# EAGLE design Femtoduino (EAGLE 8.4.3)
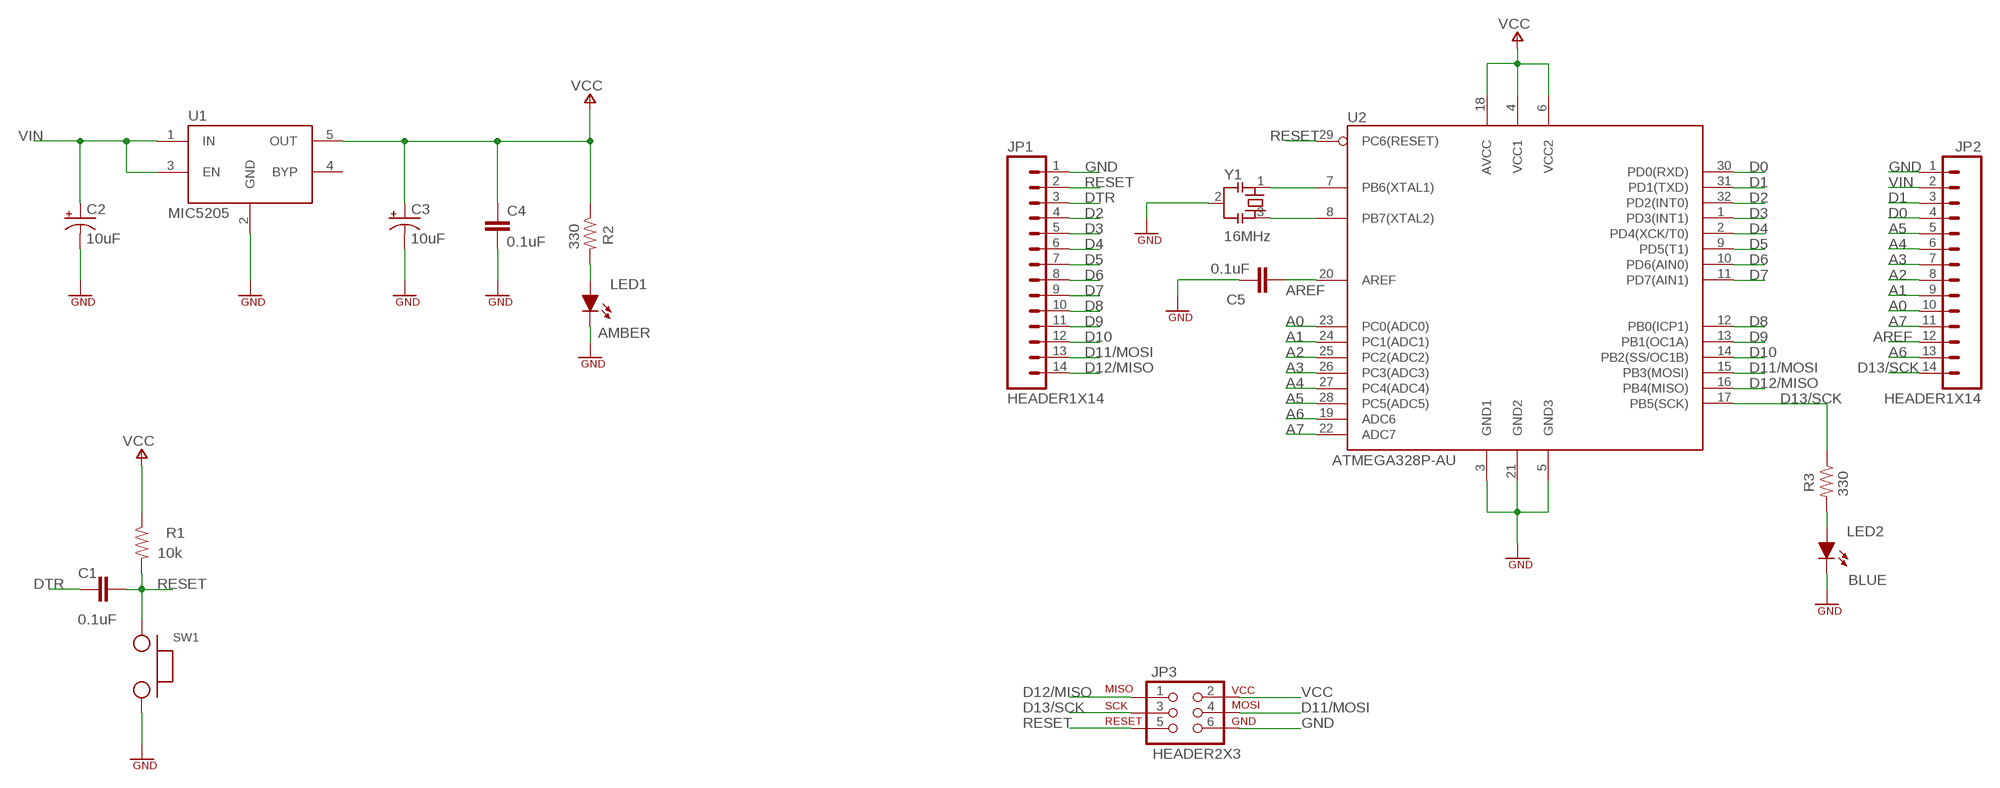
[diagram p0: schematic, sheet 1]

## Parts
C1  0.1uF  CAP_0603  [SMD0603]
C2  10uF  CAP_TANT  [EIA3216]
C3  10uF  CAP_TANT  [EIA3216]
C4  0.1uF  CAP_0603  [SMD0603]
C5  0.1uF  CAP_0603  [SMD0603]
JP1  HEADER1X14  [1X14]
JP2  HEADER1X14  [1X14]
JP3  HEADER2X3  [2X3]
LED1  AMBER  LED_0603  [LED_0603]
LED2  BLUE  LED_0805  [LED_0805]
R1  10k  RES_0603  [SMD0603]
R2  330  RES_0603  [SMD0603]
R3  330  RES_0603  [SMD0603]
SW1  SWITCH  [SWITCH-SPST]
U1  MIC5205  [SOT23-5]
U2  ATMEGA328P-AU  [TQFP32]
Y1  16MHz  CSTCE  [CSTCE]

## Nets
A0: JP2.10 U2.23(PC0(ADC0))
A1: JP2.9 U2.24(PC1(ADC1))
A2: JP2.8 U2.25(PC2(ADC2))
A3: JP2.7 U2.26(PC3(ADC3))
A4: JP2.6 U2.27(PC4(ADC4))
A5: JP2.5 U2.28(PC5(ADC5))
A6: JP2.13 U2.19(ADC6)
A7: JP2.11 U2.22(ADC7)
AREF: C5.1 JP2.12 U2.20(AREF)
D0: JP2.4 U2.30(PD0(RXD))
D1: JP2.3 U2.31(PD1(TXD))
D2: JP1.4 U2.32(PD2(INT0))
D3: JP1.5 U2.1(PD3(INT1))
D4: JP1.6 U2.2(PD4(XCK/T0))
D5: JP1.7 U2.9(PD5(T1))
D6: JP1.8 U2.10(PD6(AIN0))
D7: JP1.9 U2.11(PD7(AIN1))
D8: JP1.10 U2.12(PB0(ICP1))
D9: JP1.11 U2.13(PB1(OC1A))
D10: JP1.12 U2.14(PB2(SS/OC1B))
D11/MOSI: JP1.13 JP3.4 U2.15(PB3(MOSI))
D12/MISO: JP1.14 JP3.1 U2.16(PB4(MISO))
D13/SCK: JP2.14 JP3.3 R3.1 U2.17(PB5(SCK))
DTR: C1.1 JP1.3
GND [GND]: C2.C(-) C3.C(-) C4.2 C5.2 JP1.1 JP2.1 JP3.6 LED1.C LED2.C SW1.2 U1.2(GND) U2.3(GND1) U2.5(GND3) U2.21(GND2) Y1.2
N$2: LED1.A R2.2
N$3: U2.7(PB6(XTAL1)) Y1.1
N$4: U2.8(PB7(XTAL2)) Y1.3
N$8: LED2.A R3.2
RESET: C1.2 JP1.2 JP3.5 R1.2 SW1.1 U2.29(PC6(RESET))
VCC: C3.A(+) C4.1 JP3.2 R1.1 R2.1 U1.5(OUT) U2.4(VCC1) U2.6(VCC2) U2.18(AVCC)
VIN: C2.A(+) JP2.2 U1.1(IN) U1.3(EN)
Unconnected: U1.4(BYP)

## Library data of the parts
C1 C4 C5 = eagle-book:CAP: Non-polarized capacitor
C2 C3 = eagle-book:CAP_TANT: Polarized capacitor (Tantalum)
JP1 JP2 = eagle-book:HEADER1X14: 14-pin header with pins spaced 0.1" apart
JP3 = eagle-book:HEADER2X3: 6-pin header with pins spaced 0.1" apart (HEADD6)
LED1 LED2 = eagle-book:LED: Light Emitting Diode
R1-R3 = eagle-book:RES: Resistor
SW1 = eagle-book:SWITCH: Two-input single pole, single throw (SPST) switch
U1 = eagle-book:MIC5205: 5-volt voltage regulator (UA78M05)
U2 = eagle-book:ATMEGA328P: Atmel 32-pin 8-bit microcontroller
Y1 = eagle-book:CSTCE: SMD resonator from Murata (CSTCE16M0V53-S0)

## Net classes
0 default: width 0.203 mm
1 VCC: width 0.305 mm, drill 0.406 mm
2 VIN: width 0.305 mm, drill 0.406 mm
3 AREF: width 0.254 mm, drill 0.406 mm
4 GND: width 0.254 mm, drill 0.406 mm

## Board
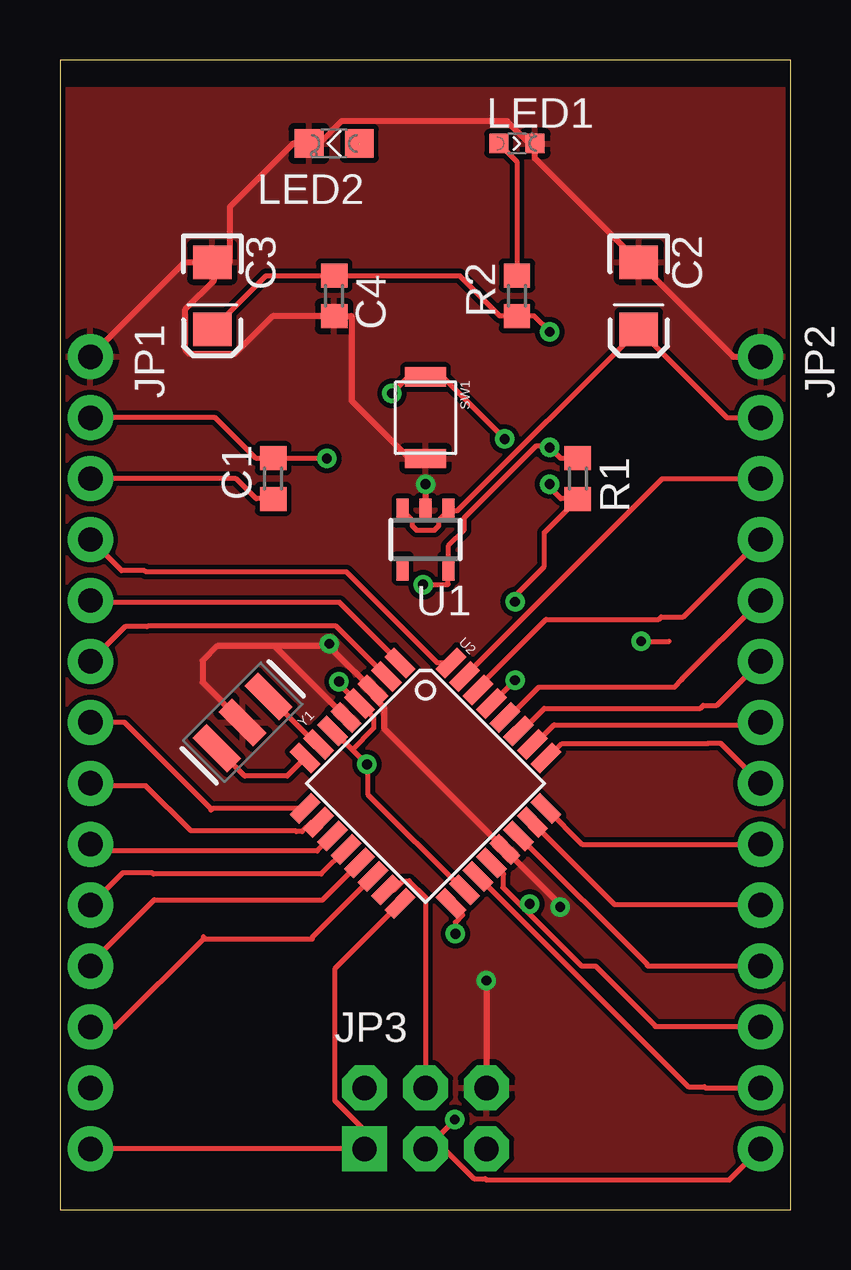
[diagram p1: board, top side]
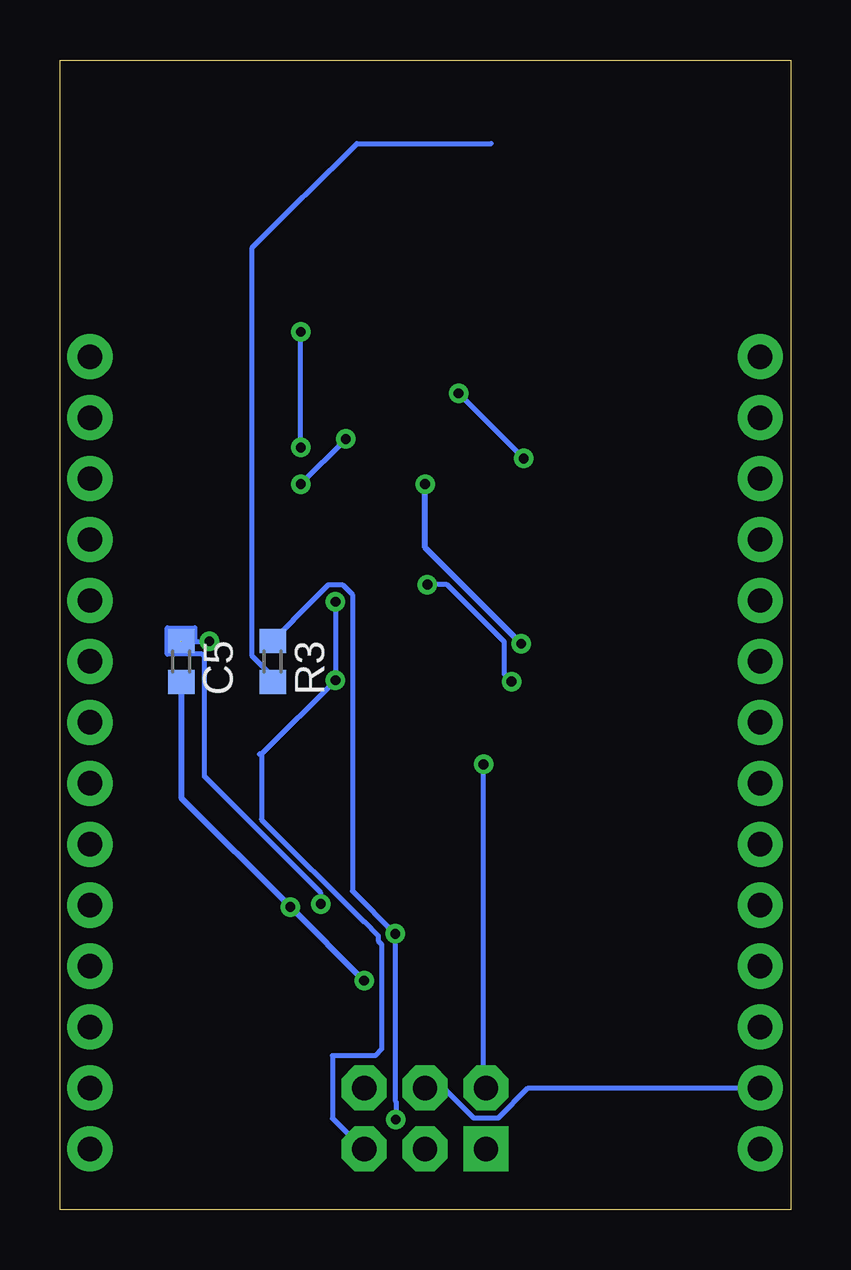
[diagram p2: board, bottom side, seen from below]

Size 30.46 x 47.93 mm. Coordinates in mm from the lower left corner, seen from the top.
Outline: 0,0 30.46,0 30.46,47.93 0,47.93 0,0
Copper layers (1*16): Top 0.035mm / dielectric 1.5mm / Bottom 0.035mm
Design rules "femtoduino": minimum track width 8mil, minimum drill 16mil, track to track 8mil, track to pad 8mil, pad to pad 8mil, via to via 8mil, smd to smd 8mil, copper to edge 8mil, drill to drill 8mil, minimum pad ring 10mil, minimum via ring 8mil, stop-mask expansion 4mil, vias tented up to drill 0mil, thermal gap 10mil

### Footprints (pad centres in the part's own frame; a part is rotated, then mirrored left to right if it is on the bottom)
SMD0603 = smd 1 x 1.1: 1 -0.85,0; 2 0.85,0
EIA3216 = smd 1.4 x 1.6: A 1.4,0; C -1.4,0
1X14 = drill 1.016 pad 1.88: 1 0,0; 2 2.54,0; 3 5.08,0; 4 7.62,0; 5 10.16,0; 6 12.7,0; 7 15.24,0; 8 17.78,0; 9 20.32,0; 10 22.86,0; 11 25.4,0; 12 27.94,0; 13 30.48,0; 14 33.02,0
2X3 = drill 1.016 pad 1.88 square: 1 -2.54,-1.27 | drill 1.016 pad 1.88 octagon: 2 -2.54,1.27; 3 0,-1.27; 4 0,1.27; 5 2.54,-1.27; 6 2.54,1.27
LED_0603 = smd 0.8 x 0.8: A 0,-0.75; C 0,0.75
LED_0805 = smd 1.2 x 1.2: A 0,-1.05; C 0,1.05
SWITCH-SPST = smd 0.8 x 1.7: 1 -1.7,0; 2 1.7,0
SOT23-5 = smd 0.5 x 1: 1 -0.95,-1.2; 2 0,-1.2; 3 0.95,-1.2; 4 0.95,1.2; 5 -0.95,1.2
TQFP32 = smd 1.27 x 0.559: 1 -4.293,2.8; 2 -4.293,2; 3 -4.293,1.2; 4 -4.293,0.4; 5 -4.293,-0.4; 6 -4.293,-1.2; 7 -4.293,-2; 8 -4.293,-2.8; 17 4.293,-2.8; 18 4.293,-2; 19 4.293,-1.2; 20 4.293,-0.4; 21 4.293,0.4; 22 4.293,1.2; 23 4.293,2; 24 4.293,2.8 | smd 0.559 x 1.27: 9 -2.8,-4.293; 10 -2,-4.293; 11 -1.2,-4.293; 12 -0.4,-4.293; 13 0.4,-4.293; 14 1.2,-4.293; 15 2,-4.293; 16 2.8,-4.293; 25 2.8,4.293; 26 2,4.293; 27 1.2,4.293; 28 0.4,4.293; 29 -0.4,4.293; 30 -1.2,4.293; 31 -2,4.293; 32 -2.8,4.293
CSTCE = smd 0.8 x 2.032: 1 -1.524,0; 2 0,0; 3 1.524,0

### Placement (x,y rotation side)
C1  8.89,30.48 90 top
C2  24.13,38.1 270 top
C3  6.35,38.1 270 top
C4  11.43,38.1 270 top
C5  25.4,22.86 270 bottom
JP1  1.27,35.56 270 top
JP2  29.21,35.56 270 top
JP3  15.24,3.81 0 top
LED1  19.05,44.45 270 top
LED2  11.43,44.45 90 top
R1  21.59,30.48 270 top
R2  19.05,38.1 90 top
R3  21.59,22.86 270 bottom
SW1  15.24,33.02 270 top
U1  15.24,27.94 180 top
U2  15.24,17.78 315 top
Y1  7.62,20.32 225 top

### Tracks (layer width: path | path; a pad name or v marks a point on that pad's centre or on a via)
A0
  Top 0.203: U2.23 23.12,12.72 29.18,12.72 JP2.10
A1
  Top 0.203: U2.24 20.28,16.73 21.77,15.24 JP2.9
A2
  Top 0.203: U2.25 20.33,18.84 20.93,19.43 27,19.43 27.03,19.46 27.53,19.46 JP2.8
A3
  Top 0.203: U2.26 19.78,19.4 20.6,20.22 29.11,20.22 JP2.7
A4
  Top 0.203: U2.27 19.26,19.97 20.19,20.9 26.7,20.9 26.82,21.03 27.38,21.03 JP2.6
A5
  Top 0.203: U2.28 18.7,20.53 19.96,21.79 25.63,21.79 25.93,22.1 25.93,22.12 JP2.5
A6
  Top 0.203: U2.19 26.19,5.13 26.87,5.13 26.92,5.08 JP2.13
A7
  Top 0.203: U2.22 24.49,10.23 24.49,10.19 24.51,10.16 JP2.11
AREF  (via drill 0.41)  (1 unrouted)
  Top 0.203: JP2.12 29.18,7.64 24.84,7.64 | 24.84,7.64 24.81,7.64 | 19.37,12.54 18.47,13.44 18.47,13.97 18.49,13.99 18.01,14.48 U2.20 | 19.37,12.54 21.74,10.16 22.33,10.16 24.84,7.64 | v24.23,23.7 25.4,23.7 | 19.37,12.54 v19.58,12.75
  Bottom 0.203: v24.23,23.7 24.84,23.7 24.84,24.26 25.98,24.26 25.98,23.16 24.54,23.16 24.43,23.06 24.43,18.06 19.58,13.21 v19.58,12.75
D0
  Top 0.203: U2.30 17.43,21.77 20.27,24.61 24.97,24.61 25.07,24.71 25.98,24.71 JP2.4
D1
  Top 0.203: U2.31 25.11,30.48 JP2.3
D2
  Top 0.203: U2.32 15.74,22.8 11.94,26.59 3.58,26.59 3.53,26.64 2.56,26.64 JP1.4
D3
  Top 0.203: U2.1 11.66,25.32 1.35,25.32 JP1.5
D4
  Top 0.203: U2.2 11.52,24.33 3.66,24.33 3.63,24.31 2.72,24.31 JP1.6
D5
  Top 0.203: U2.9 6.36,16.73 6.3,16.66 6.3,16.71 2.69,20.32 JP1.7
D6
  Top 0.203: U2.10 10.48,16.16 10.1,15.77 9.85,15.77 9.82,15.8 5.46,15.8 3.58,17.68 1.37,17.68 JP1.8
D7
  Top 0.203: U2.11 10.72,14.96 1.55,14.96 JP1.9
D8
  Top 0.203: U2.12 10.89,13.99 3.89,13.99 3.83,14.05 2.62,14.05 JP1.10
D9
  Top 0.203: U2.13 10.93,12.9 3.96,12.9 3.94,12.93 1.27,10.26 JP1.11
D10
  Top 0.203: U2.14 10.52,11.36 10.52,11.28 6.07,11.28 5.99,11.35 | 5.97,11.38 5.99,11.35 | 5.99,11.35 5.99,11.3 2.31,7.62 JP1.12
D11/MOSI
  Top 0.203: U2.15 13.92,13.33 14.31,13.72 14.56,13.72 15.24,13.04 JP3.4
  Bottom 0.203: JP3.4 14.46,5.08 13.22,3.83 12.18,3.83 10.94,5.08 JP1.13
D12/MISO
  Top 0.203: JP1.14 JP3.1 12.7,3.32 11.46,4.56 11.46,10.04 U2.16
D13/SCK  (via drill 0.41)
  Top 0.203: v16.46,3.76 JP3.3 16.02,2.54 17.26,1.29 17.73,1.29 17.78,1.25 27.91,1.25 JP2.14 | v16.48,11.51 16.48,11.99 16.79,12.29 16.31,12.78 U2.17
  Bottom 0.203: v16.46,3.76 16.46,4.52 16.48,4.55 v16.48,11.51 18.26,13.28 18.26,25.64 18.68,26.06 19.27,26.06 20.73,24.59 20.73,24.57 R3.1
DTR
  Top 0.203: JP1.3 7.34,30.48 8.18,29.64 8.89,29.64 C1.1
GND  (via drill 0.41)
  Top 0.254: U2.5 8.97,23.49 8.97,23.5 | 8.97,23.5 6.55,23.5 5.94,22.89 5.94,22 Y1.2 | 11.23,23.5 11.3,23.5 11.46,23.34 11.46,23.26 U2.3 13.05,21.39 13.51,20.93 13.51,20.07 U2.21 | 11.23,23.5 8.97,23.5 | JP2.1 28.07,35.56 C2.C 19.8,43.83 LED1.C 19.57,44.45 18.64,45.38 11.74,45.38 10.81,44.45 LED2.C 9.73,44.45 7.09,41.81 7.09,39.52 7.06,39.5 6.45,39.5 6.42,39.5 | JP1.1 5.21,39.5 C3.C 6.42,39.5 | SW1.2 14.58,31.32 12.17,33.73 12.17,37.24 12.14,37.26 11.43,37.26 C4.2 8.87,37.25 7.29,35.67 5.41,35.67 5.22,35.86 5.22,37.54 6.42,38.74 6.42,39.5 | v15.24,30.25 U1.2 | v11.23,23.6 11.23,23.5 | U2.21 | U2.21 20.85,12.72 v20.85,12.62 | v17.78,9.55 JP3.6
  Bottom 0.254: v15.24,30.25 15.24,27.61 v11.23,23.6 | v17.78,9.55 v20.85,12.62 25.4,17.17 C5.2
  pour Top: 0.25,46.74 0.25,0.25 30.23,0.25 30.23,46.74
  pour Top: 0.25,0.25 30.23,0.25 30.23,46.74 0.25,46.74
N$2
  Top 0.203: LED1.A 19.05,43.7 R2.2
N$3
  Top 0.203: U2.7 10.69,19.4 Y1.1
N$4
  Top 0.203: U2.8 9.58,18.19 | 9.58,18.19 | 9.58,18.19 9.47,18.09 7.7,18.09 Y1.3
N$8  (1 unrouted)
  Bottom 0.203: R3.2 21.59,22.23 22.45,23.08 22.45,40.12 20.32,42.24 20.24,42.29 18.09,44.45 LED2.A
RESET  (via drill 0.41)
  Top 0.203: 18.97,25.6 v18.97,25.35 19.02,25.65 20.19,26.82 20.19,28.23 R1.2 21.46,29.64 20.88,29.64 20.42,30.1 v20.42,30.25 | v18.97,22.07 18.01,21.11 U2.29 | v18.54,32.13 15.95,34.72 SW1.1 15.16,34.72 14.53,34.72 v13.84,34.04 | v11.12,31.32 8.89,31.32 C1.2 8.81,31.32 8.18,31.32 6.48,33.02 JP1.2
  Bottom 0.203: v18.97,25.35 v18.97,22.07 22.05,19 | v20.42,30.25 v18.54,32.13 | v13.84,34.04 v11.12,31.32 | 22.05,19 22.15,19 | 17.83,2.54 18.44,2.54 | 17.83,2.54 JP3.5 | 22.05,19 22.05,16.31 22.07,16.28 17.8,12.01 17.78,12.01 17.2,11.43 17.2,11.21 17.04,11.06 17.04,6.71 17.32,6.43 19.1,6.43 19.1,3.81 17.83,2.54
VCC  (via drill 0.41)
  Top 0.203: 12.19,19.18 11.38,19.99 U2.6 | 12.19,19.18 v12.8,18.57 12.85,18.49 12.85,17.3 16.84,13.31 U2.18 | 12.19,19.18 13.08,20.07 13.08,20.52 U2.4 12.42,21.13 11.63,21.92 v11.63,22.02 | v20.42,36.6 19.76,37.26 19.05,37.26 R2.1 18.97,37.26 18.34,37.26 16.66,38.94 11.43,38.94 | R1.1 21.59,31.32 20.88,31.32 v20.42,31.77 20.34,31.83 19.84,31.83 16.84,28.83 16.84,28.32 16.18,27.66 16.18,26.82 U1.5 16.18,26.72 16.18,26.09 16.15,26.06 v15.14,26.06 | 11.43,38.94 C4.1 | C3.A 8.59,38.94 11.43,38.94
  Bottom 0.203: 12.65,5.13 JP3.2 12.7,5.21 12.8,5.31 v12.8,18.57 | v20.42,31.77 v20.42,36.6 | v15.14,26.06 14.33,26.06 11.94,23.67 11.94,22.33 v11.63,22.02
VIN
  Top 0.203: U1.3 14.69,28.75 14.69,28.51 14.86,28.34 15.62,28.34 15.79,28.51 15.79,28.75 U1.1 16.57,29.14 C2.A 27.81,33.02 JP2.2